# Altium schematic sheet 11_iMX 8X_SPI & ADC.SchDoc
size A3; SheetNumber: 12; SheetTotal: 24
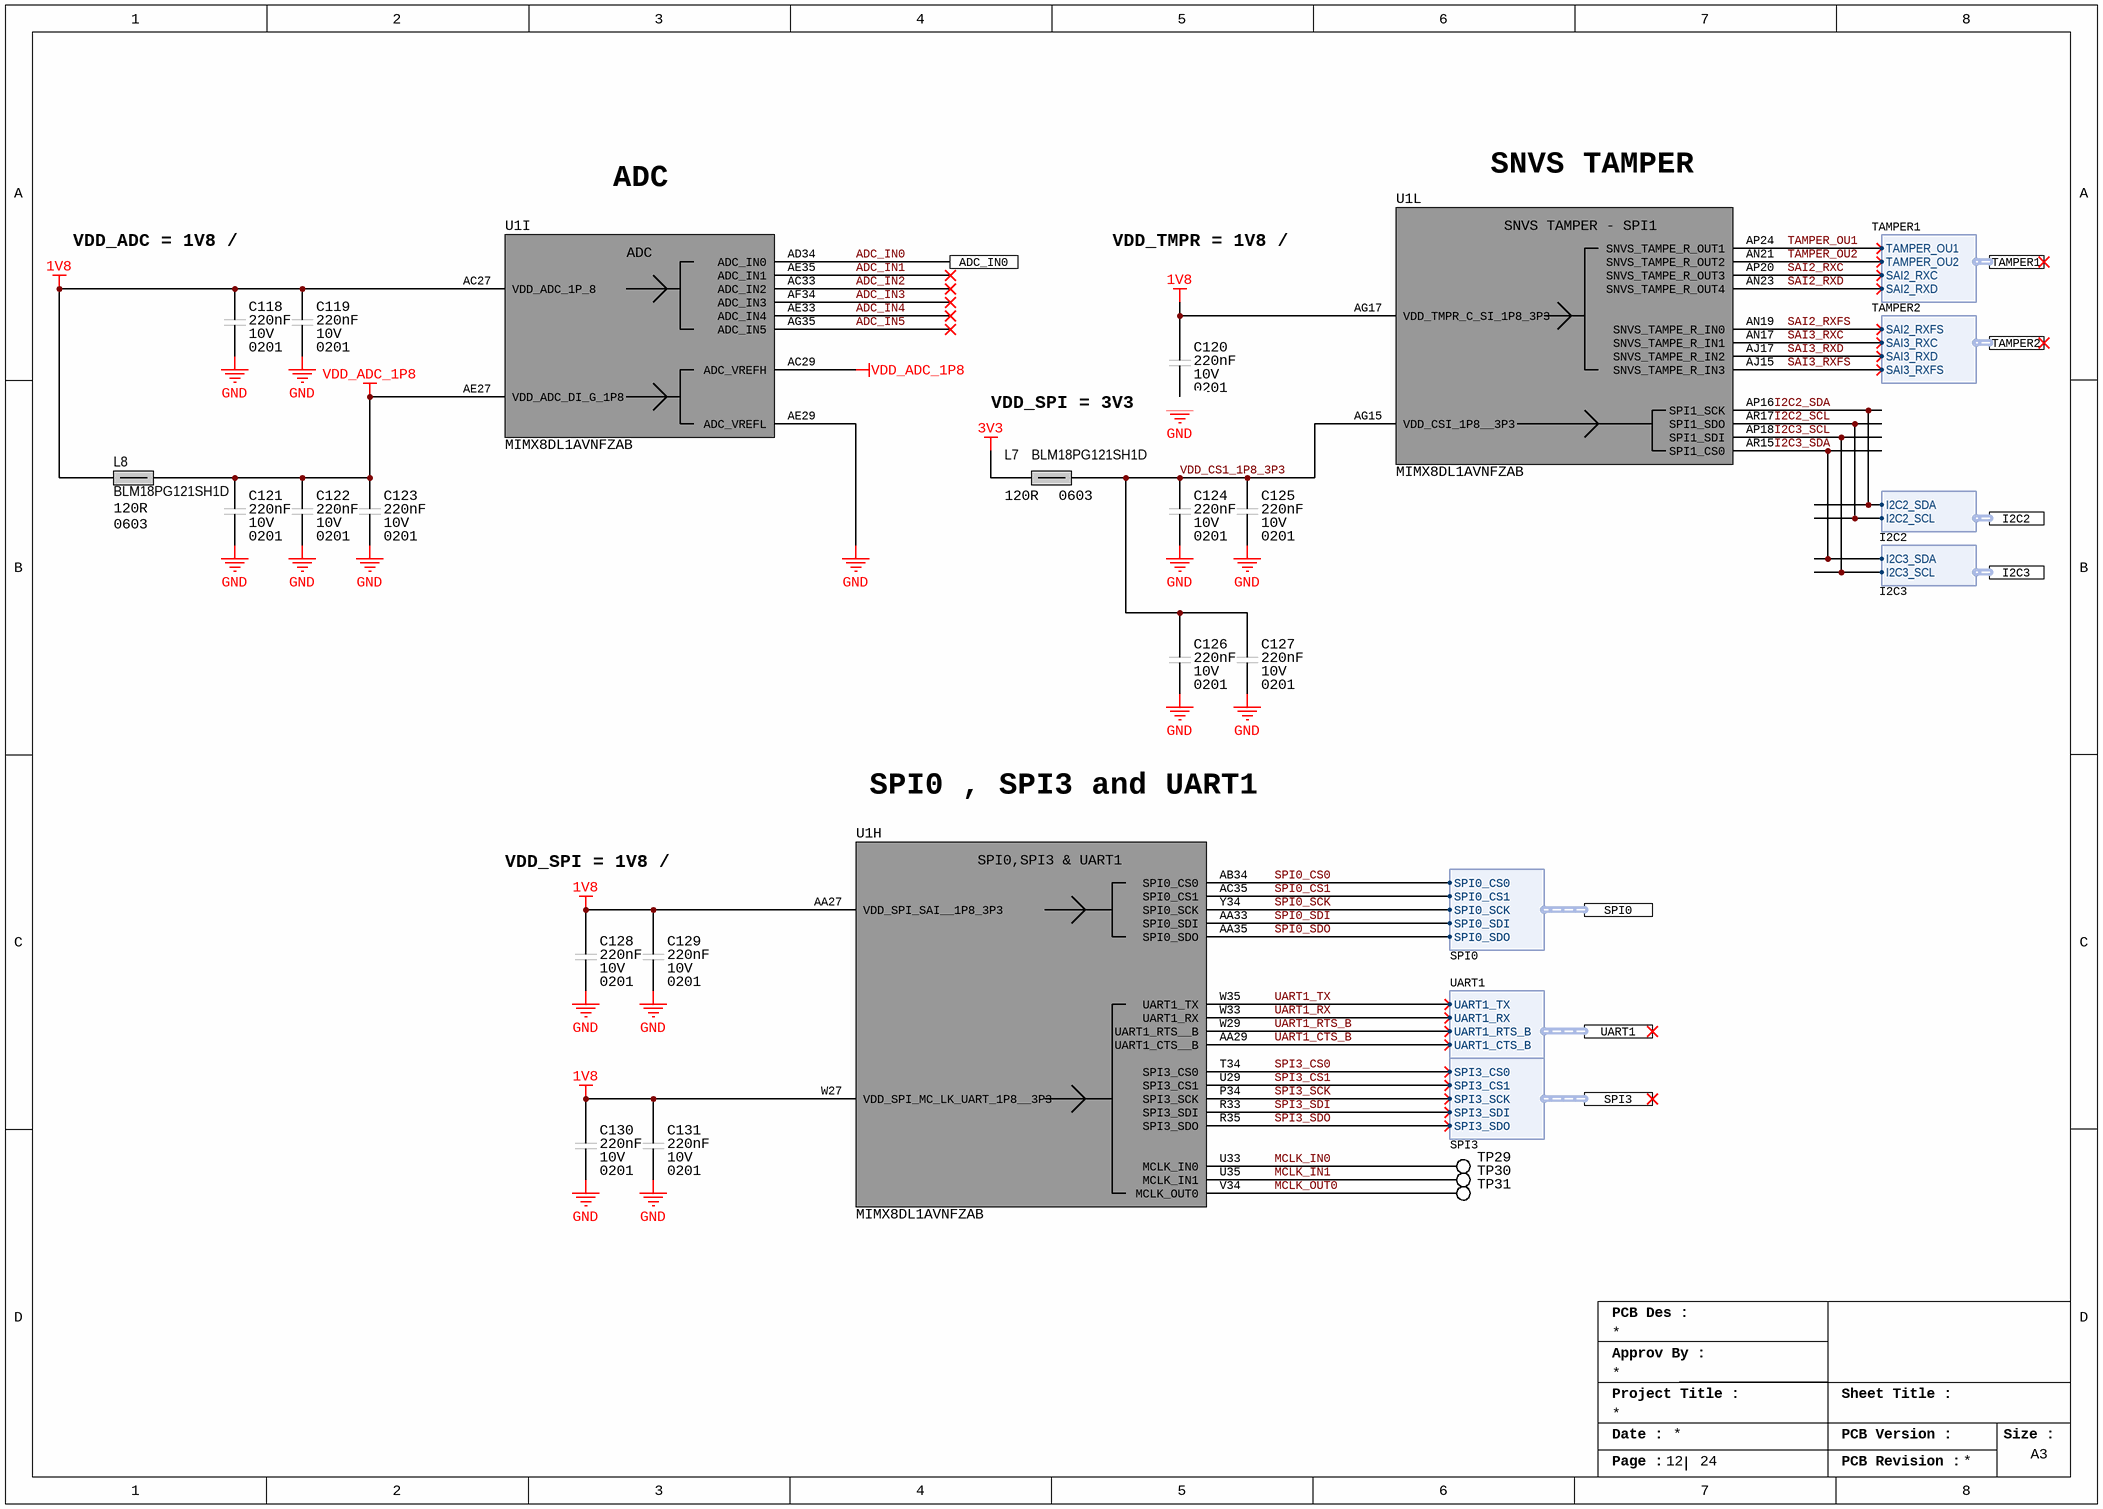
[diagram p0: 11_iMX 8X_SPI & ADC.SchDoc]

## Parts
C118  Voltage Rating (DC): 10V  Capacitance: 220nF  Case/Package: 0201  [CAP_0201_CAPC0603X03N]  (hidden comment: LMK063BJ224MP-F)
C119  Voltage Rating (DC): 10V  Capacitance: 220nF  Case/Package: 0201  [CAP_0201_CAPC0603X03N]  (hidden comment: LMK063BJ224MP-F)
C120  Voltage Rating (DC): 10V  Capacitance: 220nF  Case/Package: 0201  [CAP_0201_CAPC0603X03N]  (hidden comment: LMK063BJ224MP-F)
C121  Voltage Rating (DC): 10V  Capacitance: 220nF  Case/Package: 0201  [CAP_0201_CAPC0603X03N]  (hidden comment: LMK063BJ224MP-F)
C122  Voltage Rating (DC): 10V  Capacitance: 220nF  Case/Package: 0201  [CAP_0201_CAPC0603X03N]  (hidden comment: LMK063BJ224MP-F)
C123  Voltage Rating (DC): 10V  Capacitance: 220nF  Case/Package: 0201  [CAP_0201_CAPC0603X03N]  (hidden comment: LMK063BJ224MP-F)
C124  Voltage Rating (DC): 10V  Capacitance: 220nF  Case/Package: 0201  [CAP_0201_CAPC0603X03N]  (hidden comment: LMK063BJ224MP-F)
C125  Voltage Rating (DC): 10V  Capacitance: 220nF  Case/Package: 0201  [CAP_0201_CAPC0603X03N]  (hidden comment: LMK063BJ224MP-F)
C126  Voltage Rating (DC): 10V  Capacitance: 220nF  Case/Package: 0201  [CAP_0201_CAPC0603X03N]  (hidden comment: LMK063BJ224MP-F)
C127  Voltage Rating (DC): 10V  Capacitance: 220nF  Case/Package: 0201  [CAP_0201_CAPC0603X03N]  (hidden comment: LMK063BJ224MP-F)
C128  Voltage Rating (DC): 10V  Capacitance: 220nF  Case/Package: 0201  [CAP_0201_CAPC0603X03N]  (hidden comment: LMK063BJ224MP-F)
C129  Voltage Rating (DC): 10V  Capacitance: 220nF  Case/Package: 0201  [CAP_0201_CAPC0603X03N]  (hidden comment: LMK063BJ224MP-F)
C130  Voltage Rating (DC): 10V  Capacitance: 220nF  Case/Package: 0201  [CAP_0201_CAPC0603X03N]  (hidden comment: LMK063BJ224MP-F)
C131  Voltage Rating (DC): 10V  Capacitance: 220nF  Case/Package: 0201  [CAP_0201_CAPC0603X03N]  (hidden comment: LMK063BJ224MP-F)
L7  BLM18PG121SH1D  Impedance: 120R  Case/Package: 0603  [IND_0603_INDC1608X08N]
L8  BLM18PG121SH1D  Impedance: 120R  Case/Package: 0603  [IND_0603_INDC1608X08N]
TP29  NO COMPONENT  [TP_PAD_0.5MM_SMD_ROUND]  (value not drawn)  (no BOM)
TP30  NO COMPONENT  [TP_PAD_0.5MM_SMD_ROUND]  (value not drawn)  (no BOM)
TP31  NO COMPONENT  [TP_PAD_0.5MM_SMD_ROUND]  (value not drawn)  (no BOM)
U1  MIMX8DL1AVNFZAB  [MIMX8DL1AVNFZAB]  (parts H,I,L of 15)

## Ports
ADC_IN0, I2C2 (harness I2C2), I2C3 (harness I2C3), SPI0 (harness SPI0), SPI3 (harness SPI3), TAMPER1 (harness TAMPER1), TAMPER2 (harness TAMPER2), UART1 (harness UART1)

## Harnesses
SPI0: SPI0_CS0, SPI0_CS1, SPI0_SCK, SPI0_SDI, SPI0_SDO
SPI3: SPI3_CS0, SPI3_CS1, SPI3_SCK, SPI3_SDI, SPI3_SDO
UART1: UART1_TX, UART1_RX, UART1_RTS_B, UART1_CTS_B
TAMPER1: TAMPER_OU1, TAMPER_OU2, SAI2_RXC, SAI2_RXD
TAMPER2: SAI2_RXFS, SAI3_RXC, SAI3_RXD, SAI3_RXFS
I2C2: I2C2_SDA, I2C2_SCL
I2C3: I2C3_SDA, I2C3_SCL

## Nets
1V8: C118.2 C119.2 C120.2 C128.2 C129.2 C130.2 C131.2 L8.1 U1.AA27(VDD_SPI_SAI__1P8_3P3) U1.AC27(VDD_ADC_1P_8) U1.AG17(VDD_TMPR_C_SI_1P8_3P3) U1.W27(VDD_SPI_MC_LK_UART_1P8__3P3)
3V3: L7.1
GND: C118.1 C119.1 C120.1 C121.1 C122.1 C123.1 C124.1 C125.1 C126.1 C127.1 C128.1 C129.1 C130.1 C131.1 U1.AE29(ADC_VREFL)
VDD_ADC_1P8: C121.2 C122.2 C123.2 L8.2 U1.AC29(ADC_VREFH) U1.AE27(VDD_ADC_DI_G_1P8)
ADC_IN0: U1.AD34(ADC_IN0) ; port ADC_IN0
ADC_IN1: U1.AE35(ADC_IN1)
ADC_IN2: U1.AC33(ADC_IN2)
ADC_IN3: U1.AF34(ADC_IN3)
ADC_IN4: U1.AE33(ADC_IN4)
ADC_IN5: U1.AG35(ADC_IN5)
I2C2_SCL: U1.AR17(SPI1_SDO) ; port I2C2.I2C2_SCL
I2C2_SDA: U1.AP16(SPI1_SCK) ; port I2C2.I2C2_SDA
I2C3_SCL: U1.AP18(SPI1_SDI) ; port I2C3.I2C3_SCL
I2C3_SDA: U1.AR15(SPI1_CS0) ; port I2C3.I2C3_SDA
MCLK_IN0: TP29.1 U1.U33(MCLK_IN0)
MCLK_IN1: TP30.1 U1.U35(MCLK_IN1)
MCLK_OUT0: TP31.1 U1.V34(MCLK_OUT0)
SAI2_RXC: U1.AP20(SNVS_TAMPE_R_OUT3) ; port TAMPER1.SAI2_RXC
SAI2_RXD: U1.AN23(SNVS_TAMPE_R_OUT4) ; port TAMPER1.SAI2_RXD
SAI2_RXFS: U1.AN19(SNVS_TAMPE_R_IN0) ; port TAMPER2.SAI2_RXFS
SAI3_RXC: U1.AN17(SNVS_TAMPE_R_IN1) ; port TAMPER2.SAI3_RXC
SAI3_RXD: U1.AJ17(SNVS_TAMPE_R_IN2) ; port TAMPER2.SAI3_RXD
SAI3_RXFS: U1.AJ15(SNVS_TAMPE_R_IN3) ; port TAMPER2.SAI3_RXFS
SPI0_CS0: U1.AB34(SPI0_CS0) ; port SPI0.SPI0_CS0
SPI0_CS1: U1.AC35(SPI0_CS1) ; port SPI0.SPI0_CS1
SPI0_SCK: U1.Y34(SPI0_SCK) ; port SPI0.SPI0_SCK
SPI0_SDI: U1.AA33(SPI0_SDI) ; port SPI0.SPI0_SDI
SPI0_SDO: U1.AA35(SPI0_SDO) ; port SPI0.SPI0_SDO
SPI3_CS0: U1.T34(SPI3_CS0) ; port SPI3.SPI3_CS0
SPI3_CS1: U1.U29(SPI3_CS1) ; port SPI3.SPI3_CS1
SPI3_SCK: U1.P34(SPI3_SCK) ; port SPI3.SPI3_SCK
SPI3_SDI: U1.R33(SPI3_SDI) ; port SPI3.SPI3_SDI
SPI3_SDO: U1.R35(SPI3_SDO) ; port SPI3.SPI3_SDO
TAMPER_OU1: U1.AP24(SNVS_TAMPE_R_OUT1) ; port TAMPER1.TAMPER_OU1
TAMPER_OU2: U1.AN21(SNVS_TAMPE_R_OUT2) ; port TAMPER1.TAMPER_OU2
UART1_CTS_B: U1.AA29(UART1_CTS__B) ; port UART1.UART1_CTS_B
UART1_RTS_B: U1.W29(UART1_RTS__B) ; port UART1.UART1_RTS_B
UART1_RX: U1.W33(UART1_RX) ; port UART1.UART1_RX
UART1_TX: U1.W35(UART1_TX) ; port UART1.UART1_TX
VDD_CS1_1P8_3P3: C124.2 C125.2 C126.2 C127.2 L7.2 U1.AG15(VDD_CSI_1P8__3P3)

## Notes on the sheet
- SNVS TAMPER
- VDD_ADC = 1V8 / 2.5A
- ADC
- VDD_TMPR = 1V8 / 2.5A
- (near C120) VDD_SPI = 3V3
- SPI0 , SPI3 and UART1
- VDD_SPI = 1V8 / 2.5A
- PCB Des :
- Approv By :
- Project Title :
- Sheet Title :
- Date :
- PCB Version :
- Size :
- A3
- Page :
- PCB Revision :
- (in symbol IC_MPU_ARM_1.2GHz_MIMX8DL1AVNFZAB, part H) SPI0,SPI3 & UART1
- (in symbol IC_MPU_ARM_1.2GHz_MIMX8DL1AVNFZAB, part I) ADC
- (in symbol IC_MPU_ARM_1.2GHz_MIMX8DL1AVNFZAB, part L) SNVS TAMPER - SPI1

## Library data of the parts
C118-C131 = CAP_0.22UF_10V_X5R_0201: Multilayer Ceramic Capacitors (High dielectric type), 10V, 0.22 uF, ± 20 %, 0201, X5R, RoHS; Manufacturer: Taiyo Yuden; Material: 4241ConductorMaterial; Tolerance: 20%; Supplier 1: Digikey; Manufacturer Part Number: LMK063BJ224MP-F; RoHS: Yes; Category: Ceramic Capacitors; Stock 1: 6053224; Pricing 1: 1=0.12, 10=0.08, 50=0.0478, 100=0.0375, 500=0.02772, 1000=0.02295, 2500=0.02136, 5000=0.01954 (USD); Mount: Surface Mount; Case Code (Metric): 0603; Case Code (Imperial): 0201; Min Operating Temperature: -55°C; Max Operating Temperature: 85°C; Voltage Rating: 10V; Packaging: Tape and Reel; Package Quantity: 15000; Dielectric: X5R; Termination: SMD/SMT; Voltage: 10V; Series: M; Construction: Flat; Length: 0.6mm; Width: 0.3mm; Height: 0.3mm; Depth: 0.3mm; Radiation Hardening: No; Halogen Free: Halogen Free; RoHS Compliant: Yes; Reach SVHC Compliant: Unknown; ComponentLink1URL: https://datasheet.ciiva.com/134/lmk063bj224mp-f-ss-134995.pdf?src-supplier=Digikey; ComponentLink1Description: https://datasheet.ciiva.com/134/lmk063bj224mp-f-ss-134995.pdf?src-supplier=Digikey; ComponentLink2URL: https://datasheet.ciiva.com/11464/lmk063bj224mp-f-ss-11464053.pdf?src-supplier=Avnet; ComponentLink2Description: https://datasheet.ciiva.com/11464/lmk063bj224mp-f-ss-11464053.pdf?src-supplier=Avnet; ComponentLink3URL: https://datasheet.ciiva.com/15921/1589lmk063bj224mp-f-15921250.pdf?src-supplier=Onlinecomponents.com; ComponentLink3Description: https://datasheet.ciiva.com/15921/1589lmk063bj224mp-f-15921250.pdf?src-supplier=Onlinecomponents.com; ComponentLink4URL: https://datasheet.ciiva.com/26872/getdatasheetpartid-639019-26872592.pdf?src-supplier=Verical; ComponentLink4Description: https://datasheet.ciiva.com/26872/getdatasheetpartid-639019-26872592.pdf?src-supplier=Verical; ComponentLink5URL: https://datasheet.ciiva.com/30243/100lmk063bj224mp-f-30243150.pdf?src-supplier=Onlinecomponents.com; ComponentLink5Description: https://datasheet.ciiva.com/30243/100lmk063bj224mp-f-30243150.pdf?src-supplier=Onlinecomponents.com; ComponentLink6URL: https://datasheet.ciiva.com/28645/746258-28645141.pdf?src-supplier=Element14; ComponentLink6Description: https://datasheet.ciiva.com/28645/746258-28645141.pdf?src-supplier=Element14; ComponentLink7URL: https://datasheet.ciiva.com/5422/mlcc-all-e-541559-5422365.pdf?src-supplier=Mouser; ComponentLink7Description: https://datasheet.ciiva.com/5422/mlcc-all-e-541559-5422365.pdf?src-supplier=Mouser; Supplier Part Number 1: 587-2483-1-ND
L7 L8 = IND_FERRITE_BEADS_120R_2A_0603_BLM18PG121SH1D: Ferrite Beads Multi-Layer 120Ohm 25% 100MHz 2A 50mOhm DCR 0603 Automotive Paper T/R; Manufacturer: Murata; Number of Lines: 1; Shielding: Unshielded; DC Resistance-Max: 50mR; Supplier 1: Digi-Key; Manufacturer Part Number: BLM18PG121SH1D; RoHS: Yes; Category: Ferrite Beads and Chips; Stock 1: 282143; Pricing 1: 1=0.11, 10=0.086, 25=0.0772, 50=0.0566, 100=0.0489, 250=0.03864, 500=0.03262, 1000=0.02747 (USD); Mount: Surface Mount; Case Code (Metric): 1608; Case Code (Imperial): 0603; Weight: 7.1E-05oz; Contact Plating: Tin,Matte; Material: Ferrite; Min Operating Temperature: -55°C; Max Operating Temperature: 125°C; Tolerance: 25%; Packaging: Tape and Reel; Package Quantity: 1; Current Rating: 2A; Max Current Rating: 2A; Termination: SMD/SMT; Max DC Current: 2A; Test Frequency: 100MHz; Number of Circuits: 1; Series: EMIFIL®, BLM18P; Length: 1.6mm; Width: 0.031inch; Height: 0.8mm; Depth: 0.8mm; Ratings: AEC-Q200; Lead Free: Lead Free; RoHS Compliant: Yes; ComponentLink1URL: https://datasheet.octopart.com/BLM18PG121SH1D-Murata-datasheet-141273661.pdf?src-supplier=Element14; ComponentLink1Description: https://datasheet.octopart.com/BLM18PG121SH1D-Murata-datasheet-141273661.pdf?src-supplier=Element14; ComponentLink2URL: https://datasheet.octopart.com/BLM18PG121SH1D-Murata-datasheet-62086335.pdf?src-supplier=Future+Electronics; ComponentLink2Description: https://datasheet.octopart.com/BLM18PG121SH1D-Murata-datasheet-62086335.pdf?src-supplier=Future+Electronics; ComponentLink3URL: http://search.murata.co.jp/Ceramy/image/img/PDF/ENG/L0132S0193BLM18P.pdf?src-supplier=Avnet; ComponentLink3Description: http://search.murata.co.jp/Ceramy/image/img/PDF/ENG/L0132S0193BLM18P.pdf?src-supplier=Avnet; ComponentLink4URL: https://www.murata.com/en-us/products/productdata/8796738650142/ENFA0003.pdf?src-supplier=Digi-Key; ComponentLink4Description: https://www.murata.com/en-us/products/productdata/8796738650142/ENFA0003.pdf?src-supplier=Digi-Key; Supplier Part Number 1: 490-7815-6-ND
TP29-TP31 = TP_PAD_SMD_SMALL: Test Point, SMD pad, round, 1.5mm, 1.6mm, 3mm diameter
U1 = IC_MPU_ARM_1.2GHz_MIMX8DL1AVNFZAB: I.MX8 Dxl 15SQ / Tray Rohs Compliant: Yes; Manufacturer: NXP Semiconductors; Supplier 1: Mouser; Manufacturer Part Number: MIMX8DL1AVNFZAB; RoHS: No; Category: Uncategorized; Stock 1: 196; Pricing 1: 1=46.19, 10=40.26, 25=38.57, 50=38.56, 100=33.3, 252=33.16, 1000=33.3, 10000=33.3 (USD); Supplier Part Number 1: 771-MIMX8DL1AVNFZAB